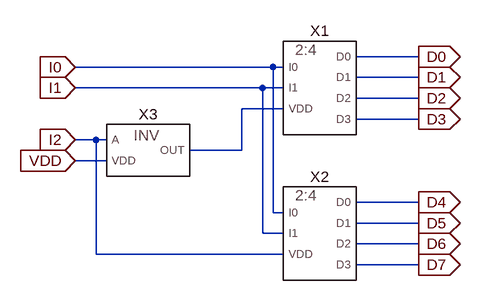
[diagram p0: schematic Dec3to8.asc]
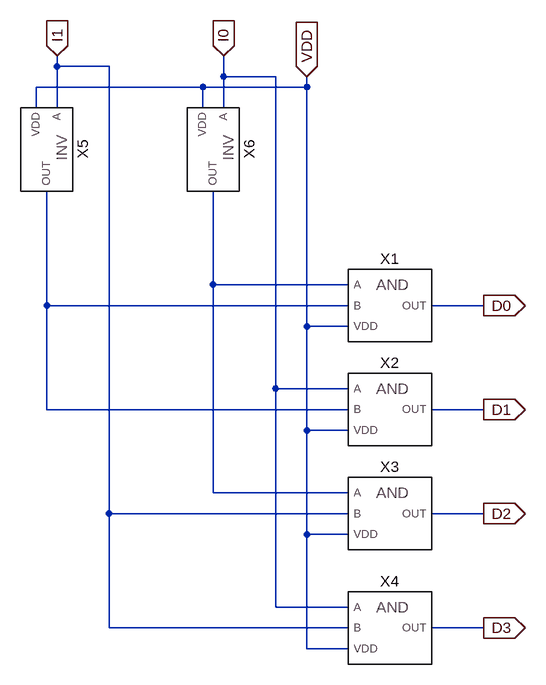
[diagram p1: sub-circuit dec2to4.asc]
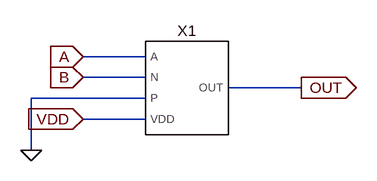
[diagram p2: sub-circuit andgdi.asc]
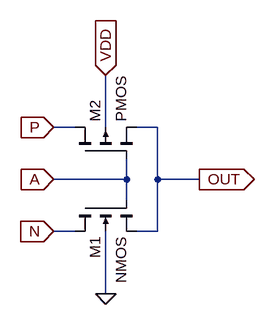
[diagram p3: sub-circuit gdicell.asc]
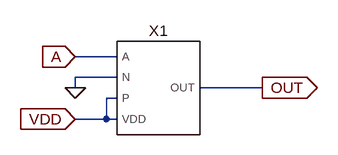
[diagram p4: sub-circuit invgdi.asc]
Dec3to8.asc, the LTspice schematic file:
Version 4
SHEET 1 880 680
WIRE 320 48 224 48
WIRE 96 64 -208 64
WIRE 112 64 96 64
WIRE 320 80 224 80
WIRE 80 96 -208 96
WIRE 112 96 80 96
WIRE 320 112 224 112
WIRE 112 128 48 128
WIRE 320 144 224 144
WIRE -176 176 -208 176
WIRE -160 176 -176 176
WIRE 48 192 48 128
WIRE 48 192 -32 192
WIRE -160 208 -208 208
WIRE 320 272 224 272
WIRE 96 288 96 64
WIRE 112 288 96 288
WIRE 320 304 224 304
WIRE 80 320 80 96
WIRE 112 320 80 320
WIRE 320 336 224 336
WIRE -176 352 -176 176
WIRE 112 352 -176 352
WIRE 320 368 224 368
FLAG -208 64 I0
IOPIN -208 64 In
FLAG -208 96 I1
IOPIN -208 96 In
FLAG -208 176 I2
IOPIN -208 176 In
FLAG 320 48 D0
IOPIN 320 48 Out
FLAG 320 80 D1
IOPIN 320 80 Out
FLAG 320 112 D2
IOPIN 320 112 Out
FLAG 320 144 D3
IOPIN 320 144 Out
FLAG 320 272 D4
IOPIN 320 272 Out
FLAG 320 304 D5
IOPIN 320 304 Out
FLAG 320 336 D6
IOPIN 320 336 Out
FLAG 320 368 D7
IOPIN 320 368 Out
FLAG -208 208 VDD
IOPIN -208 208 In
SYMBOL Dec2to4 160 96 R0
SYMATTR InstName X1
SYMBOL Dec2to4 160 320 R0
SYMATTR InstName X2
SYMBOL INVgdi -96 192 R0
SYMATTR InstName X3

dec2to4.asc, the sub-circuit schematic file:
Version 4
SHEET 1 880 680
WIRE -224 -336 -224 -352
WIRE -144 -336 -224 -336
WIRE 32 -320 32 -352
WIRE 112 -320 32 -320
WIRE 0 -304 -256 -304
WIRE 160 -304 160 -320
WIRE 160 -304 0 -304
WIRE -256 -272 -256 -304
WIRE -224 -272 -224 -336
WIRE 0 -272 0 -304
WIRE 32 -272 32 -320
WIRE 16 0 16 -144
WIRE 224 0 16 0
WIRE -240 32 -240 -144
WIRE 224 32 -240 32
WIRE 432 32 352 32
WIRE 160 64 160 -304
WIRE 224 64 160 64
WIRE 112 160 112 -320
WIRE 224 160 112 160
WIRE -240 192 -240 32
WIRE 224 192 -240 192
WIRE 432 192 352 192
WIRE 160 224 160 64
WIRE 224 224 160 224
WIRE 16 320 16 0
WIRE 224 320 16 320
WIRE -144 352 -144 -336
WIRE 224 352 -144 352
WIRE 432 352 352 352
WIRE 160 384 160 224
WIRE 224 384 160 384
WIRE 112 496 112 160
WIRE 224 496 112 496
WIRE -144 528 -144 352
WIRE 224 528 -144 528
WIRE 432 528 352 528
WIRE 160 560 160 384
WIRE 224 560 160 560
FLAG -224 -352 I1
IOPIN -224 -352 In
FLAG 32 -352 I0
IOPIN 32 -352 In
FLAG 160 -320 VDD
IOPIN 160 -320 In
FLAG 432 32 D0
IOPIN 432 32 Out
FLAG 432 192 D1
IOPIN 432 192 Out
FLAG 432 352 D2
IOPIN 432 352 Out
FLAG 432 528 D3
IOPIN 432 528 Out
SYMBOL ANDgdi 288 32 R0
SYMATTR InstName X1
SYMBOL ANDgdi 288 192 R0
SYMATTR InstName X2
SYMBOL ANDgdi 288 352 R0
SYMATTR InstName X3
SYMBOL ANDgdi 288 528 R0
SYMATTR InstName X4
SYMBOL INVgdi -240 -208 R90
SYMATTR InstName X5
SYMBOL INVgdi 16 -208 R90
SYMATTR InstName X6

andgdi.asc, the sub-circuit schematic file:
Version 4
SHEET 1 880 680
WIRE -32 192 -128 192
WIRE -32 224 -128 224
WIRE 208 240 96 240
WIRE -32 256 -208 256
WIRE -32 288 -128 288
WIRE -208 336 -208 256
FLAG -128 192 A
IOPIN -128 192 In
FLAG -128 224 B
IOPIN -128 224 In
FLAG -128 288 VDD
IOPIN -128 288 In
FLAG 208 240 OUT
IOPIN 208 240 Out
FLAG -208 336 0
SYMBOL GDICell 32 240 R0
SYMATTR InstName X1

gdicell.asc, the sub-circuit schematic file:
Version 4
SHEET 1 880 680
WIRE 176 96 144 96
WIRE 224 96 224 16
WIRE 304 96 272 96
WIRE 256 176 256 144
WIRE 256 176 144 176
WIRE 304 176 304 96
WIRE 368 176 304 176
WIRE 256 208 256 176
WIRE 176 256 144 256
WIRE 304 256 304 176
WIRE 304 256 272 256
WIRE 224 352 224 256
FLAG 144 96 P
IOPIN 144 96 In
FLAG 144 256 N
IOPIN 144 256 In
FLAG 144 176 A
IOPIN 144 176 In
FLAG 368 176 OUT
IOPIN 368 176 Out
FLAG 224 16 VDD
IOPIN 224 16 In
FLAG 224 352 0
SYMBOL nmos4 176 208 M90
SYMATTR InstName M1
SYMATTR Value2 l=65nm w=65nm
SYMBOL pmos4 176 144 R270
SYMATTR InstName M2
SYMATTR Value2 l=162.5nm w=65nm

invgdi.asc, the sub-circuit schematic file:
Version 4
SHEET 1 880 680
WIRE 176 112 112 112
WIRE 176 144 112 144
WIRE 112 160 112 144
WIRE 400 160 304 160
WIRE 176 176 160 176
WIRE 160 208 160 176
WIRE 160 208 112 208
WIRE 176 208 160 208
FLAG 112 112 A
IOPIN 112 112 In
FLAG 112 208 VDD
IOPIN 112 208 In
FLAG 400 160 OUT
IOPIN 400 160 Out
FLAG 112 160 0
SYMBOL GDICell 240 160 R0
SYMATTR InstName X1

The netlist it stands for:
* Dec3to8.asc
XX1 I0 I1 N001 D0 D1 D2 D3 dec2to4
XX2 I0 I1 I2 D4 D5 D6 D7 dec2to4
XX3 I2 VDD N001 invgdi

* block symbol definitions
.subckt dec2to4 I0 I1 VDD D0 D1 D2 D3
XX1 N001 N002 VDD D0 andgdi
XX2 I0 N002 VDD D1 andgdi
XX3 N001 I1 VDD D2 andgdi
XX4 I0 I1 VDD D3 andgdi
XX5 I1 VDD N002 invgdi
XX6 I0 VDD N001 invgdi
.ends dec2to4

.subckt andgdi A B VDD OUT
XX1 A B 0 VDD OUT gdicell
.ends andgdi

.subckt gdicell A N P VDD OUT
M1 N A OUT 0 NMOS l=65nm w=65nm
M2 P A OUT VDD PMOS l=162.5nm w=65nm
.ends gdicell

.subckt invgdi A VDD OUT
XX1 A 0 VDD VDD OUT gdicell
.ends invgdi

.model NMOS NMOS
.model PMOS PMOS
.lib standard.mos
.backanno
.end